# Altium schematic sheet Motherboard_Schematic.SchDoc: SkyPulseUAV
size 420 x 297 mm; Author: Binhan Tian; SheetNumber: 1; SheetTotal: 1
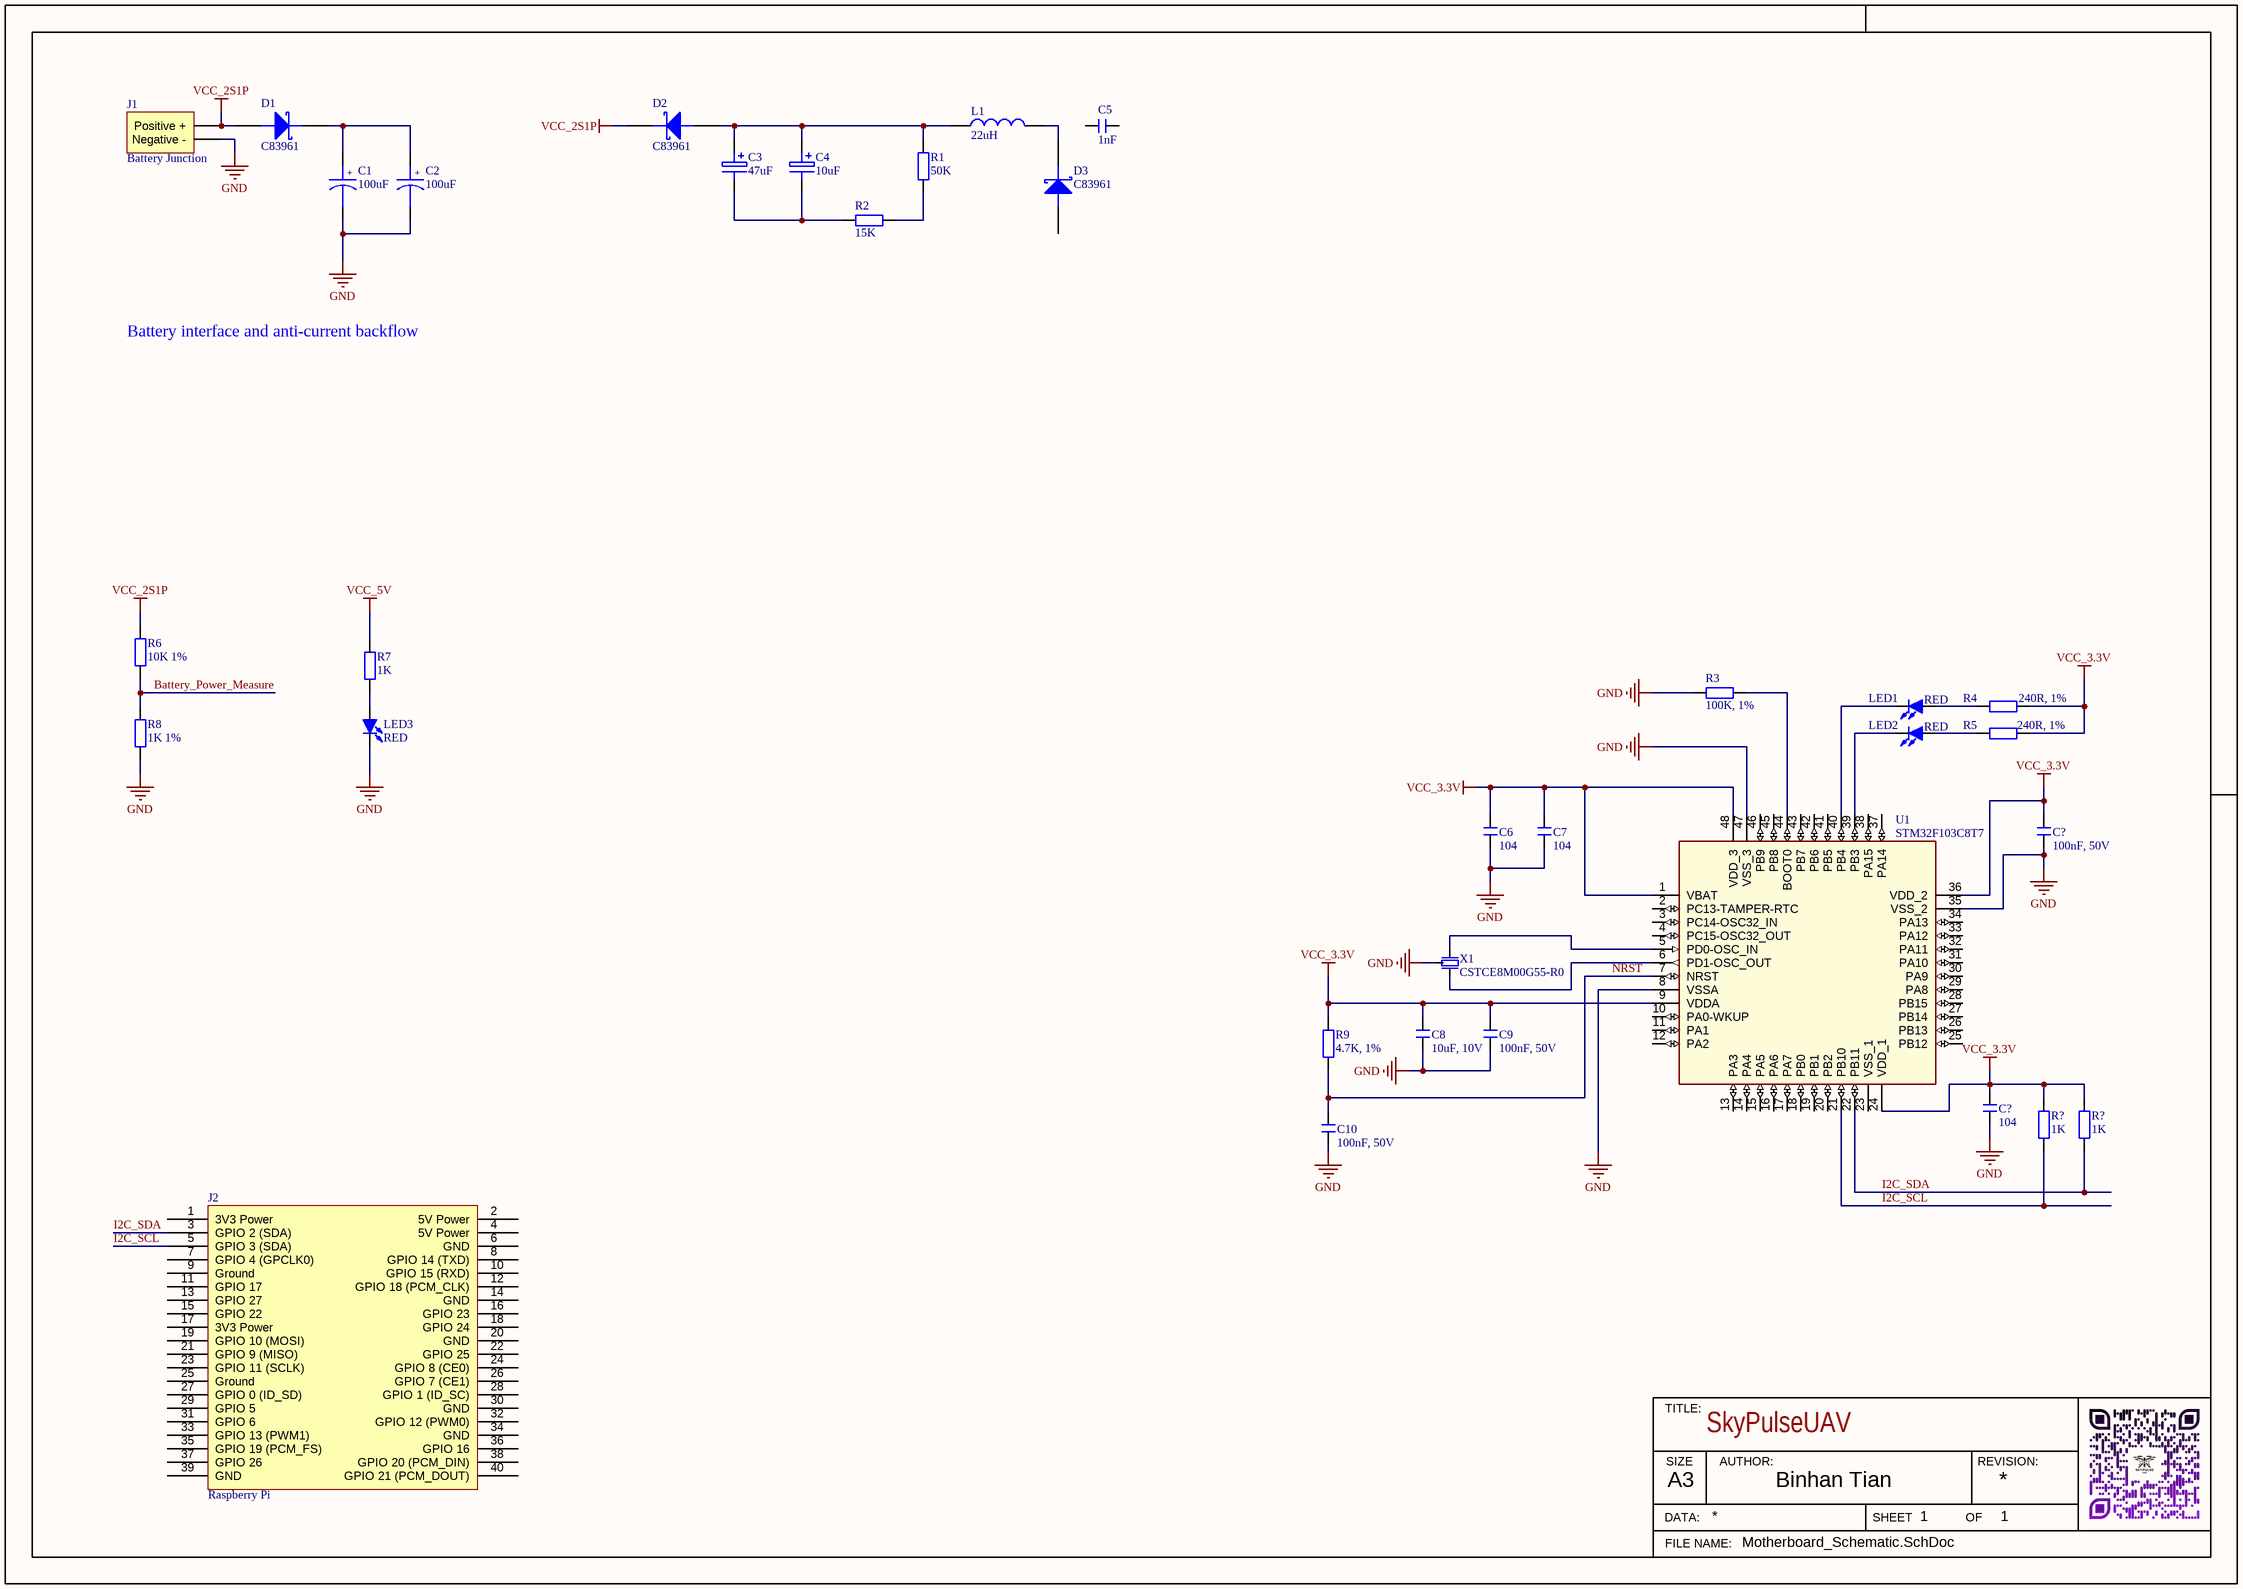
[diagram p0: Motherboard_Schematic.SchDoc]

## Parts
(Parts that share a designator on the sheet are numbered #1, #2 ... from top to bottom, then left to right.)
C1  100uF  [CM D(6.3*7.7)]
C2  100uF  [CM D(6.3*7.7)]
C3  47uF  [CD D(7343)]
C4  10uF  [CD B(3528)]
C5  1nF  [C 0805_M]
C6  104  [C 0805_M]
C7  104  [C 0805_M]
C8  10uF, 10V  [C 0805_M]
C9  100nF, 50V  [C 0805_M]
C10  100nF, 50V  [C 0805_M]
C?#1  100nF, 50V  [C 0805_M]
C?#2  104  [C 0805_M]
D1  C83961  [SMA]
D2  C83961  [SMA]
D3  C83961  [SMA]
J1  Battery Junction
J2  Raspberry Pi
L1  22uH  [CD54]
LED1  RED  [LED 0805B]
LED2  RED  [LED 0805B]
LED3  RED  [LED 0805B]
R1  50K  [R 0805_M]
R2  15K  [R 0805_M]
R3  100K, 1%  [R 0805_M]
R4  240R, 1%  [R 0805_M]
R5  240R, 1%  [R 0805_M]
R6  10K 1%  [R 0805_M]
R7  1K  [R 0805_M]
R8  1K 1%  [R 0805_M]
R9  4.7K, 1%  [R 0805_M]
R?#1  1K  [R 0805_M]
R?#2  1K  [R 0805_M]
U1  STM32F103C8T7  [TSQFP50P900X900X160-48L]
X1  CSTCE8M00G55-R0  [CSTCE_G]

## Nets
GND: C1.2 C2.2 C6.1 C7.1 C8.1 C9.1 C10.1 C?#1.1 C?#2.2 J1.2(Negative_-) LED3.2(K) R3.1 R8.1 U1.8(VSSA) U1.35(VSS_2) U1.47(VSS_3) X1.2(GND)
VCC_2S1P: D1.1 D2.2 J1.1(Positive_+) R6.2
VCC_3.3V: C6.2 C7.2 C8.2 C9.2 C?#1.2 C?#2.1 R4.2 R5.2 R9.2 R?#1.2 R?#2.2 U1.1(VBAT) U1.9(VDDA) U1.24(VDD_1) U1.36(VDD_2) U1.48(VDD_3)
VCC_5V: R7.2
Battery_Power_Measure: R6.1 R8.2
I2C_SCL: J2.5(GPIO_3_(SDA)) R?#1.1 U1.21(PB10)
I2C_SDA: J2.3(GPIO_2_(SDA)) R?#2.1 U1.22(PB11)
NRST: C10.2 R9.1 U1.7(NRST)
NetC1_1: C1.1 C2.1 D1.2
NetC3_1: C3.1 C4.1 D2.1 L1.1 R1.2
NetC3_2: C3.2(E) C4.2(E) R2.1
NetD3_2: D3.2 L1.2
NetLED1_1: LED1.1(A) R4.1
NetLED1_2: LED1.2(K) U1.40(PB4)
NetLED2_1: LED2.1(A) R5.1
NetLED2_2: LED2.2(K) U1.39(PB3)
NetLED3_1: LED3.1(A) R7.1
NetR1_1: R1.1 R2.2
NetR3_2: R3.2 U1.44(BOOT0)
NetU1_5: U1.5(PD0-OSC_IN) X1.1
NetU1_6: U1.6(PD1-OSC_OUT) X1.3

Not connected (* = marked no-connect by the designer): C5 1 2; D3 1; J2 1(3V3_Power) 2(5V_Power) 4(5V_Power) 6(GND) 7(GPIO_4_(GPCLK0)) 8(GPIO_14_(TXD)) 9(Ground) 10(GPIO_15_(RXD)) 11(GPIO_17) 12(GPIO_18_(PCM_CLK)) 13(GPIO_27) 14(GND) 15(GPIO_22) 16(GPIO_23) 17(3V3_Power) 18(GPIO_24) 19(GPIO_10_(MOSI)) 20(GND) 21(GPIO_9_(MISO)) 22(GPIO_25) 23(GPIO_11_(SCLK)) 24(GPIO_8_(CE0)) 25(Ground) 26(GPIO_7_(CE1)) 27(GPIO_0_(ID_SD)) 28(GPIO_1_(ID_SC)) 29(GPIO_5) 30(GND) 31(GPIO_6) 32(GPIO_12_(PWM0)) 33(GPIO_13_(PWM1)) 34(GND) 35(GPIO_19_(PCM_FS)) 36(GPIO_16) 37(GPIO_26) 38(GPIO_20_(PCM_DIN)) 39(GND) 40(GPIO_21_(PCM_DOUT)); U1 2(PC13-TAMPER-RTC) 3(PC14-OSC32_IN) 4(PC15-OSC32_OUT) 10(PA0-WKUP) 11(PA1) 12(PA2) 13(PA3) 14(PA4) 15(PA5) 16(PA6) 17(PA7) 18(PB0) 19(PB1) 20(PB2) 23(VSS_1) 25(PB12) 26(PB13) 27(PB14) 28(PB15) 29(PA8) 30(PA9) 31(PA10) 32(PA11) 33(PA12) 34(PA13) 37(PA14) 38(PA15) 41(PB5) 42(PB6) 43(PB7) 45(PB8) 46(PB9)

## Notes on the sheet
- Battery interface and anti-current backflow
- TITLE:
- SIZE
- AUTHOR:
- REVISION:
- DATA:
- FILE NAME:
- A3
- SHEET
- OF
- (in symbol CAP_Electrolytic) +

## Library data of the parts
C1 C2 = CAP_Electrolytic: SMD Aluminum Electrolytic Capacitors
C3 = CAP_TAN: Tantalum capacitor, 47uF, 16V
C4 = CAP_TAN_10uF: Tantalum capacitor, 10uF, 16V, CA45A-B-16V-10uF-K; Model: CA45A-B-16V-10uF-K
C5-C10 C?#1 C?#2 = CAP: SMD Capacitor
D1-D3 = SS34: SURFACE MOUNT SCHOTTKY BARRIER RECTIFIER
J1 = Battery Junction: 7.4V, 2S1P, 38.48Wh, 80C, 5200mAh
J2 = Raspberry Pi Connector: Raspberry Pi Connector, 40P
L1 = L: Inductance
LED1 LED2 = LED: SMD LED Red
LED3 = LED_SMD: SMD LED Red
R1-R5 R9 R?#1 R?#2 = RES: SMD Resistor
R6-R8 = RES: SMD Resistor; BOM名称: 贴片电阻; 版权归属: 源创客; 学习资源: www.ooocke.com
X1 = CSTCE8M00G55-R0: Crystal Oscillator CSTCE8M00G55-R0